# Altium schematic sheet DI_modified.SchDoc
size A4; SheetNumber: 3; SheetTotal: 10
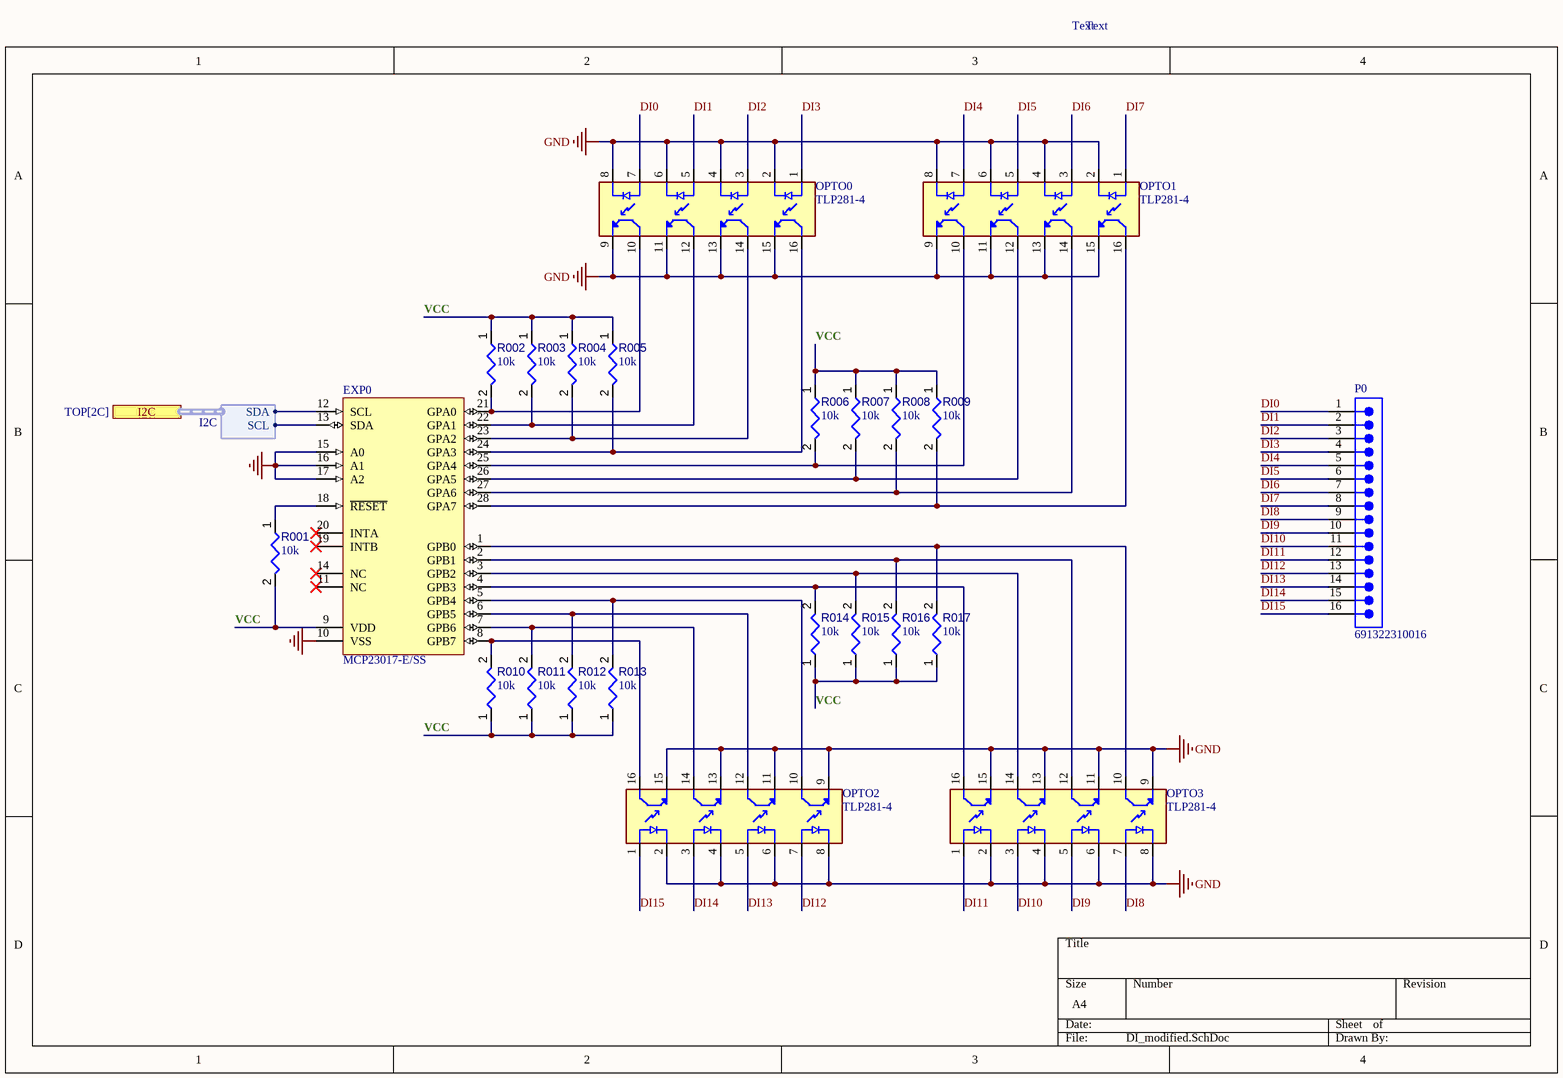
[diagram p0: DI_modified.SchDoc]

## Parts
EXP0  MCP23017-E/SS  [SSOP-SS28_M]
OPTO0  TLP281-4  [SOIC127P700X210-16N]
OPTO1  TLP281-4  [SOIC127P700X210-16N]
OPTO2  TLP281-4  [SOIC127P700X210-16N]
OPTO3  TLP281-4  [SOIC127P700X210-16N]
P0  691322310016  [691322310016]
R001  value 10k  [RESC0402(1005)_L]  (hidden comment: 10KR2F)
R002  value 10k  [RESC1005X40X25ML05T05]  (hidden comment: Resistor 10k +/-1% 0402 63 mW)
R003  value 10k  [RESC1005X40X25ML05T05]  (hidden comment: Resistor 10k +/-1% 0402 63 mW)
R004  value 10k  [RESC1005X40X25ML05T05]  (hidden comment: Resistor 10k +/-1% 0402 63 mW)
R005  value 10k  [RESC1005X40X25ML05T05]  (hidden comment: Resistor 10k +/-1% 0402 63 mW)
R006  value 10k  [RESC1005X40X25ML05T05]  (hidden comment: Resistor 10k +/-1% 0402 63 mW)
R007  value 10k  [RESC1005X40X25ML05T05]  (hidden comment: Resistor 10k +/-1% 0402 63 mW)
R008  value 10k  [RESC1005X40X25ML05T05]  (hidden comment: Resistor 10k +/-1% 0402 63 mW)
R009  value 10k  [RESC1005X40X25ML05T05]  (hidden comment: Resistor 10k +/-1% 0402 63 mW)
R010  value 10k  [RESC1005X40X25ML05T05]  (hidden comment: Resistor 10k +/-1% 0402 63 mW)
R011  value 10k  [RESC1005X40X25ML05T05]  (hidden comment: Resistor 10k +/-1% 0402 63 mW)
R012  value 10k  [RESC1005X40X25ML05T05]  (hidden comment: Resistor 10k +/-1% 0402 63 mW)
R013  value 10k  [RESC1005X40X25ML05T05]  (hidden comment: Resistor 10k +/-1% 0402 63 mW)
R014  value 10k  [RESC1005X40X25ML05T05]  (hidden comment: Resistor 10k +/-1% 0402 63 mW)
R015  value 10k  [RESC1005X40X25ML05T05]  (hidden comment: Resistor 10k +/-1% 0402 63 mW)
R016  value 10k  [RESC1005X40X25ML05T05]  (hidden comment: Resistor 10k +/-1% 0402 63 mW)
R017  value 10k  [RESC1005X40X25ML05T05]  (hidden comment: Resistor 10k +/-1% 0402 63 mW)

## Ports
I2C (harness I2C, see TOP[2C])

## Harnesses
I2C: SCL, SDA

## Nets
GND: EXP0.10(VSS) EXP0.15(A0) EXP0.16(A1) EXP0.17(A2) OPTO0.2(C1) OPTO0.4(C2) OPTO0.6(C3) OPTO0.8(C4) OPTO0.9(ET4) OPTO0.11(ET3) OPTO0.13(ET2) OPTO0.15(ET1) OPTO1.2(C1) OPTO1.4(C2) OPTO1.6(C3) OPTO1.8(C4) OPTO1.9(ET4) OPTO1.11(ET3) OPTO1.13(ET2) OPTO1.15(ET1) OPTO2.2(C1) OPTO2.4(C2) OPTO2.6(C3) OPTO2.8(C4) OPTO2.9(ET4) OPTO2.11(ET3) OPTO2.13(ET2) OPTO2.15(ET1) OPTO3.2(C1) OPTO3.4(C2) OPTO3.6(C3) OPTO3.8(C4) OPTO3.9(ET4) OPTO3.11(ET3) OPTO3.13(ET2) OPTO3.15(ET1)
DI0: OPTO0.7(A4) P0.1
DI1: OPTO0.5(A3) P0.2
DI2: OPTO0.3(A2) P0.3
DI3: OPTO0.1(A1) P0.4
DI4: OPTO1.7(A4) P0.5
DI5: OPTO1.5(A3) P0.6
DI6: OPTO1.3(A2) P0.7
DI7: OPTO1.1(A1) P0.8
DI8: OPTO3.7(A4) P0.9
DI9: OPTO3.5(A3) P0.10
DI10: OPTO3.3(A2) P0.11
DI11: OPTO3.1(A1) P0.12
DI12: OPTO2.7(A4) P0.13
DI13: OPTO2.5(A3) P0.14
DI14: OPTO2.3(A2) P0.15
DI15: OPTO2.1(A1) P0.16
VCC: EXP0.9(VDD) R001.2 R002.1 R003.1 R004.1 R005.1 R006.1 R007.1 R008.1 R009.1 R010.1 R011.1 R012.1 R013.1 R014.1 R015.1 R016.1 R017.1
NetEXP0_1: EXP0.1(GPB0) OPTO3.10(CT4) R017.2
NetEXP0_2: EXP0.2(GPB1) OPTO3.12(CT3) R016.2
NetEXP0_3: EXP0.3(GPB2) OPTO3.14(CT2) R015.2
NetEXP0_4: EXP0.4(GPB3) OPTO3.16(CT1) R014.2
NetEXP0_5: EXP0.5(GPB4) OPTO2.10(CT4) R013.2
NetEXP0_6: EXP0.6(GPB5) OPTO2.12(CT3) R012.2
NetEXP0_7: EXP0.7(GPB6) OPTO2.14(CT2) R011.2
NetEXP0_8: EXP0.8(GPB7) OPTO2.16(CT1) R010.2
NetEXP0_12: EXP0.12(SCL) ; port I2C.SDA
NetEXP0_13: EXP0.13(SDA) ; port I2C.SCL
NetEXP0_18: EXP0.18(~{RESET}) R001.1
NetEXP0_21: EXP0.21(GPA0) OPTO0.10(CT4) R002.2
NetEXP0_22: EXP0.22(GPA1) OPTO0.12(CT3) R003.2
NetEXP0_23: EXP0.23(GPA2) OPTO0.14(CT2) R004.2
NetEXP0_24: EXP0.24(GPA3) OPTO0.16(CT1) R005.2
NetEXP0_25: EXP0.25(GPA4) OPTO1.10(CT4) R006.2
NetEXP0_26: EXP0.26(GPA5) OPTO1.12(CT3) R007.2
NetEXP0_27: EXP0.27(GPA6) OPTO1.14(CT2) R008.2
NetEXP0_28: EXP0.28(GPA7) OPTO1.16(CT1) R009.2

Not connected (* = marked no-connect by the designer): EXP0 11(NC)* 14(NC)* 19(INTB)* 20(INTA)*

## Notes on the sheet
- Text

## Library data of the parts
EXP0 = CMP-015-00008-1: I²C Bus IC Operating temperature: -40...+125 °C Power supply: 1.8...5.5 V Package: SSOP-20; Max Supply Voltage: 5.5V; Min Supply Voltage: 4.5V; Max Operating Temperature: 125°C; Case/Package: SSOP; Min Operating Temperature: -40°C; Pins: 28; Mounting Technology: Surface Mount
OPTO0-OPTO3 = CMP-007-000000-1: Optoisolator Transistor Output 2500Vrms 4 Channel 16-SOP; MF: Toshiba Semiconductor; Package: SOP-16 Toshiba; Value: *; Component Type: Standard; Source: TLP281-4.SchLib; Pin Count: 16; Check_prices: https://www.snapeda.com/parts/TLP281-4/Toshiba/view-part/?ref=eda; SnapEDA_Link: https://www.snapeda.com/parts/TLP281-4/Toshiba/view-part/?ref=snap; Design Item ID: TLP281-4; MP: TLP281-4
P0 = CMP-002-00072-1: Terminal Block, 3.81MM Pitch, Horizontal Pcb Header, 300VAC, 16 Pins; Voltage Rating: 300V; Min Operating Temperature: -40°C; Max Operating Temperature: 105°C
R001 = CMP-009-00066-2: 10K 0.063W 1% 0402 (1005 Metric)  SMD; Power: 63mW; Case/Package: 0402; Mounting Technology: SMT; Pins: 2; Tolerance: 1%
R002 R003 R004 R005 R006 R007 R008 R009 R010 R011 R012 R013 R014 R015 R016 R017 = CMP-009-00019-5: Chip Resistor, 10 KOhm, +/- 1%, 63 mW, -55 to 155 degC, 0402 (1005 Metric); Power: 63mW; Voltage Rating: 50V; Case/Package: 0402; Mounting Technology: SM; Pins: 2; Min Operating Temperature: -55°C; Tolerance: 1%; RoHS Compliant: True; Max Operating Temperature: 155°C